# Altium schematic sheet MICRO-GRUPO_5-5A.schDoc.SchDoc
size A4; SheetNumber: X; SheetTotal: X; Titulo: MICROCONTROLADOR-PROYECTO; Alumno: GRUPO 5; profesor: MAHNIC, Nicolás; curso: 5to A; TPN: X; NLista: X; Asignatura: Taller de Montaje y Armador de Equipos Electrónicos; Año: 2019; Rule: PcbType=ProtelPcb
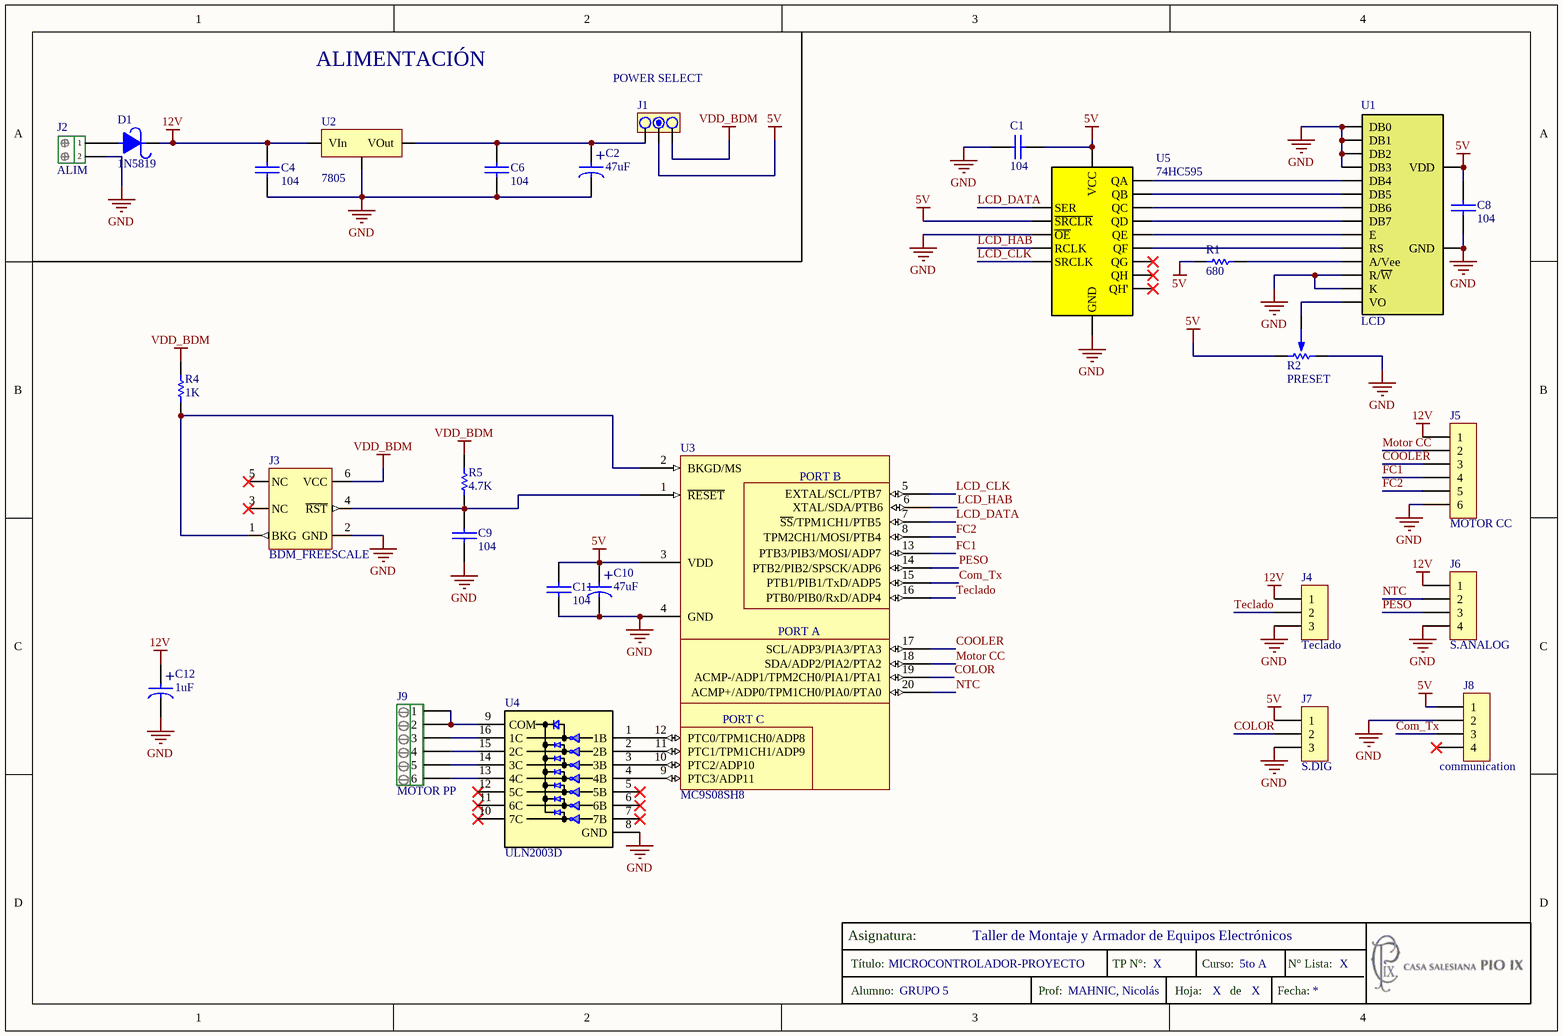
[diagram p0: MICRO-GRUPO_5-5A.schDoc.SchDoc]

## Parts
C1  104  [0805]
C2  47uF  [Capol]
C4  104  [0805]
C6  104  [0805]
C8  104  [0805]
C9  104  [0805]
C10  47uF  [Capol]
C11  104  [0805]
C12  1uF  [Capol]
D1  1N5819  [Diodo]
J1  POWER SELECT  [JUMPER_3]
J2  ALIM  [BORNERA2]
J3  BDM_FREESCALE  [SIP3*2]
J4  Teclado  [SIP3 90]
J5  MOTOR CC  [SIP6]
J6  S.ANALOG  [SIP4 90]
J7  S.DIG  [SIP3 90]
J8  communication  [SIP4 90]
J9  MOTOR PP  [BORNERA6]
R1  680  [0805]
R2  PRESET  [PRESET H]
R4  1K  [0805]
R5  4.7K  [0805]
U1  LCD  [LCD]
U2  7805  [TO-220 V]
U3  MC9S08SH8  [DIP20]
U4  ULN2003D  [SOIC16]
U5  74HC595  [74hc595_v2]

## Nets
5V: C1.2 C8.2 C10.1 C11.1 J1.2 J7.1 J8.1 R1.2 R2.1 U1.2(VDD) U3.3(VDD) U5.10(~{SRCLR}) U5.16(VCC)
12V: C4.1 C12.1 D1.2 J4.1 J5.1 J6.1 U2.1(VIn)
GND: C1.1 C2.2 C4.2 C6.2 C8.1 C9.2 C10.2 C11.2 C12.2 J2.2 J3.2(GND) J4.3 J5.6 J6.4 J7.3 J8.2 R2.3 U1.1(GND) U1.5(R/~{W}) U1.7(DB0) U1.8(DB1) U1.9(DB2) U1.10(DB3) U1.16(K) U2.2(GND) U3.4(GND) U4.8(GND) U5.8(GND) U5.13(~{OE})
VDD_BDM: J1.1 J3.6(VCC) R4.2 R5.2
COLOR: J7.2 U3.19(ACMP-/ADP1/TPM2CH0/PIA1/PTA1)
Com_Tx: J8.3 U3.15(PTB1/PIB1/TxD/ADP5)
COOLER: J5.3 U3.17(SCL/ADP3/PIA3/PTA3)
FC1: J5.4 U3.13(PTB3/PIB3/MOSI/ADP7)
FC2: J5.5 U3.8(TPM2CH1/MOSI/PTB4)
LCD_CLK: U3.5(EXTAL/SCL/PTB7) U5.11(SRCLK)
LCD_DATA: U3.7(~{SS}/TPM1CH1/PTB5) U5.14(SER)
LCD_HAB: U3.6(XTAL/SDA/PTB6) U5.12(RCLK)
Motor CC: J5.2 U3.18(SDA/ADP2/PIA2/PTA2)
NTC: J6.2 U3.20(ACMP+/ADP0/TPM1CH0/PIA0/PTA0)
PESO: J6.3 U3.14(PTB2/PIB2/SPSCK/ADP6)
Teclado: J4.2 U3.16(PTB0/PIB0/RxD/ADP4)
NetC2_1: C2.1 C6.1 J1.3 U2.3(VOut)
NetC9_1: C9.1 J3.4(~{RST}) R5.1 U3.1(~{RESET})
NetD1_1: D1.1 J2.1
NetJ3_1: J3.1(BKG) R4.1 U3.2(BKGD/MS)
NetJ9_1: J9.1 J9.2 U4.9(COM)
NetJ9_3: J9.3 U4.16(1C)
NetJ9_4: J9.4 U4.15(2C)
NetJ9_5: J9.5 U4.14(3C)
NetJ9_6: J9.6 U4.13(4C)
NetR1_1: R1.1 U1.15(A/Vee)
NetR2_2: R2.2 U1.3(VO)
NetU1_4: U1.4(RS) U5.5(QF)
NetU1_6: U1.6(E) U5.4(QE)
NetU1_11: U1.11(DB4) U5.15(QA)
NetU1_12: U1.12(DB5) U5.1(QB)
NetU1_13: U1.13(DB6) U5.2(QC)
NetU1_14: U1.14(DB7) U5.3(QD)
NetU3_9: U3.9(PTC3/ADP11) U4.4(4B)
NetU3_10: U3.10(PTC2/ADP10) U4.3(3B)
NetU3_11: U3.11(PTC1/TPM1CH1/ADP9) U4.2(2B)
NetU3_12: U3.12(PTC0/TPM1CH0/ADP8) U4.1(1B)

Not connected (* = marked no-connect by the designer): J3 3(NC)* 5(NC)*; J8 4*; U4 5(5B)* 6(6B)* 7(7B)* 10(7C)* 11(6C)* 12(5C)*; U5 6(QG)* 7(QH)* 9(QH')*

## Notes on the sheet
- ALIMENTACIÓN
- Asignatura:
- Título:
- TP N°:
- Curso:
- N° Lista:
- Alumno:
- Prof:
- Hoja:
- de
- Fecha:
- (in symbol CAPPOL) +
- (in symbol MC9S08SH8) PORT B; PORT A; PORT C

## Library data of the parts
C1 C4 C6 C8 C9 C11 = CAP: Autor: Guido Spataro; Data: Libebal; Fecha: 07/04/19
C2 C10 C12 = CAPPOL: Cap polarizado
D1 = DIODO SCHOTTKY: Diodo; Autor: Guido Spataro; DAta: https://assets.nexperia.com/documents/outline-drawing/SOD123.pdf; Fecha: 07/04/19
J1 = JUMPER_3: Jumper; Data: Libebal; Autor: Guido Spataro; Fecha: 07/04/19
J2 = Bornera_2: Bornera de 2 pines; Autor: Guido Spataro; Datasheet: Libebal; Fecha: 07/04/19
J3 = BDM: Autor: Guido Spataro; Data: Visto desde el esquematico de mash; Fecha: 07/04/19
J4 J7 = CON3
J5 = CON6
J6 J8 = CON4
J9 = BORNERA 6: current output; AUTOR: MARTINEZ Agustin; FECHA: 5/4
R1 R4 R5 = RES: Resistencia; Autor: Guido Spataro; Data: Libebal; Fecha: 07/04/19
U1 = LCD 16*4
U2 = 78XX: REGULDOR POSITIVO
U3 = MC9S08SH8: Micro controlador; Autor: Guido Spataro; data: https://www.nxp.com/docs/en/data-sheet/MC9S08SH8.pdf; Fecha: 07/04/19
U4 = ULN2003D: Controlador de corriente; AUTOR: MARTINEZ Agustin; FECHA: 5/4; DATASHEET: https://pdf1.alldatasheet.com/datasheet-pdf/view/25572/STMICROELECTRONICS/ULN2003D.html